# EAGLE design sdvx-controller-hardware (EAGLE 9.6.2)
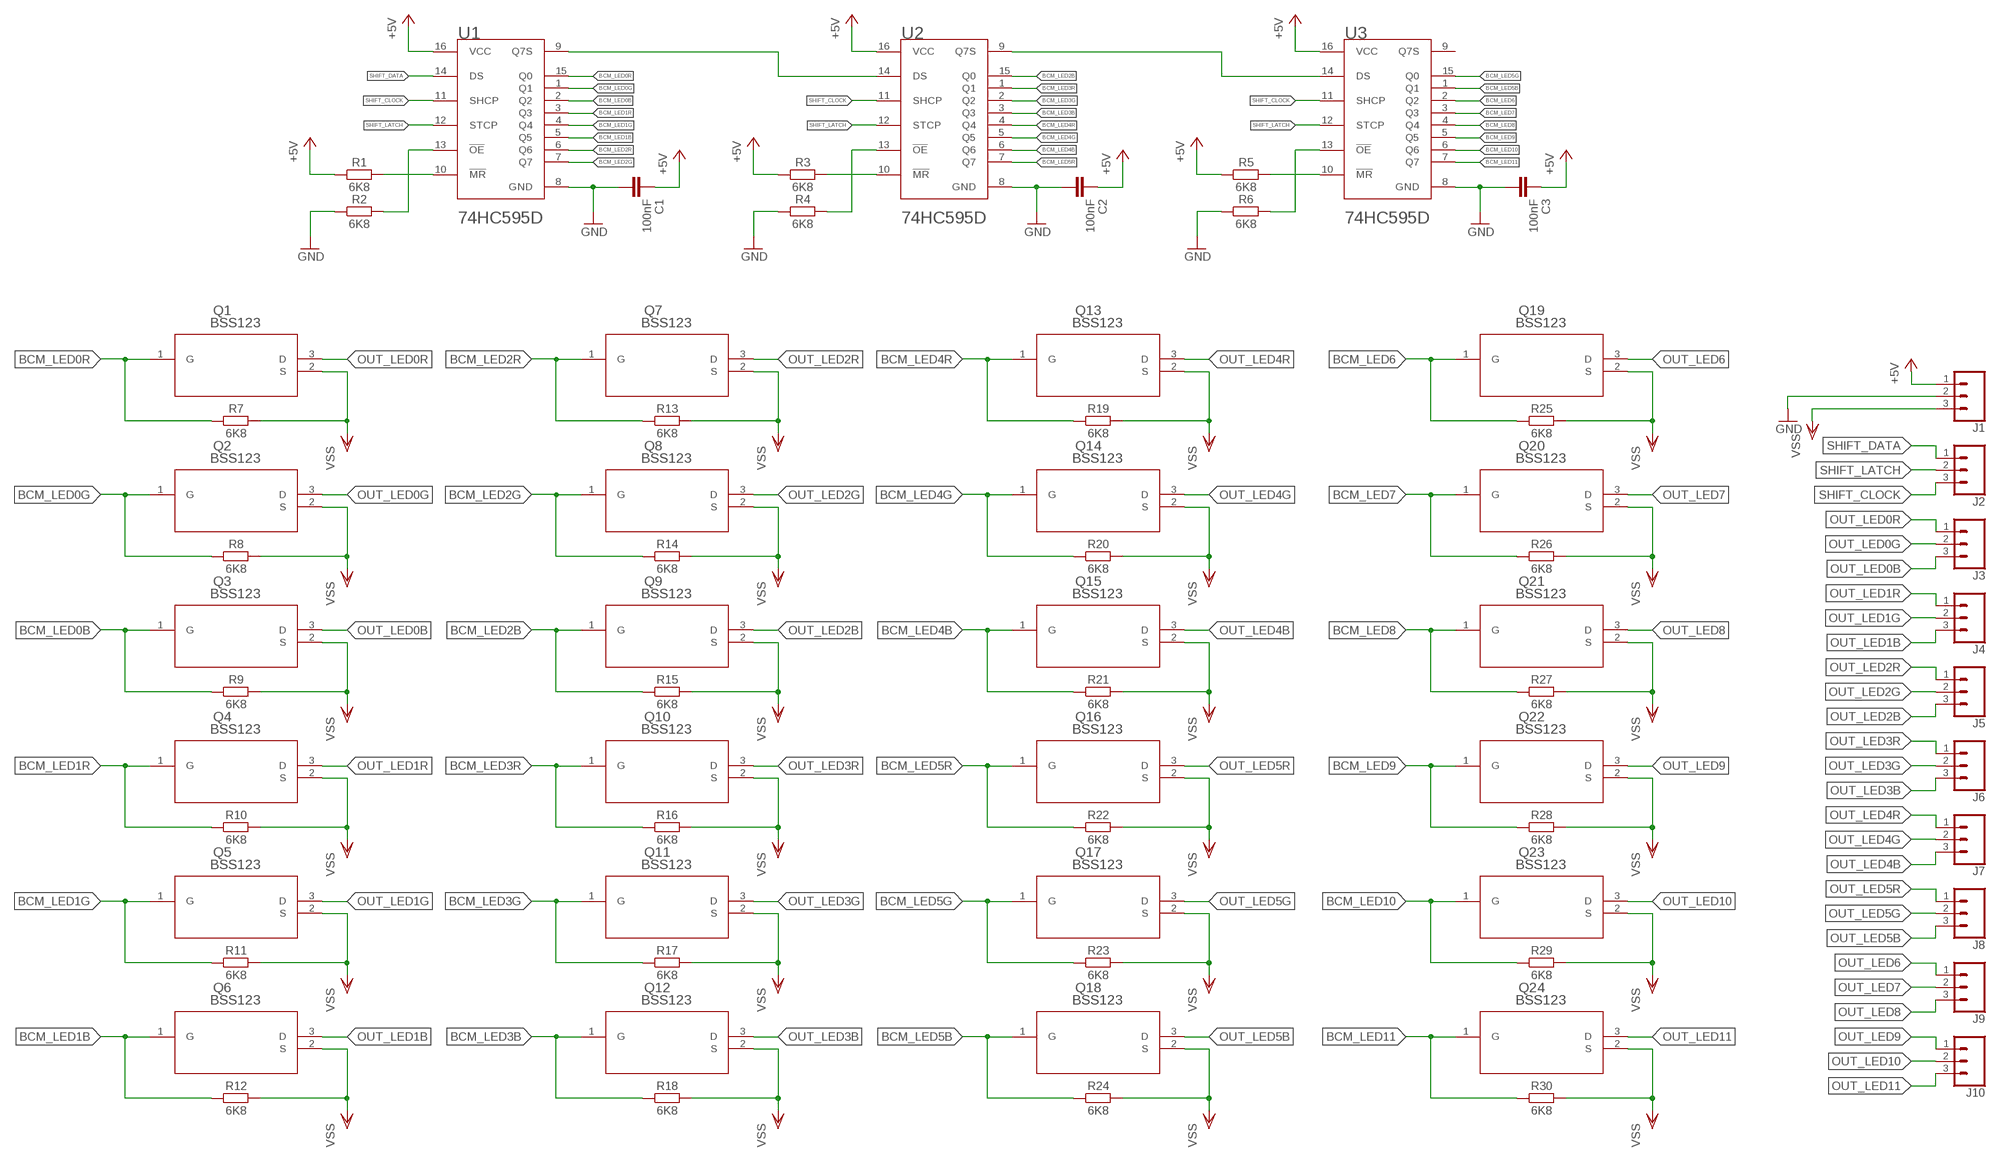
[diagram p0: schematic, sheet 1]

## Parts
C1  100nF  C_CHIP-0805(2012-METRIC)  [CAPC2012X110]
C2  100nF  C_CHIP-0805(2012-METRIC)  [CAPC2012X110]
C3  100nF  C_CHIP-0805(2012-METRIC)  [CAPC2012X110]
J1  CONN_03-SCREW-5MM  [SCREWTERMINAL-5MM-3]
J2  CONN_03-SCREW-5MM  [SCREWTERMINAL-5MM-3]
J3  CONN_03-SCREW-5MM  [SCREWTERMINAL-5MM-3]
J4  CONN_03-SCREW-5MM  [SCREWTERMINAL-5MM-3]
J5  CONN_03-SCREW-5MM  [SCREWTERMINAL-5MM-3]
J6  CONN_03-SCREW-5MM  [SCREWTERMINAL-5MM-3]
J7  CONN_03-SCREW-5MM  [SCREWTERMINAL-5MM-3]
J8  CONN_03-SCREW-5MM  [SCREWTERMINAL-5MM-3]
J9  CONN_03-SCREW-5MM  [SCREWTERMINAL-5MM-3]
J10  CONN_03-SCREW-5MM  [SCREWTERMINAL-5MM-3]
Q1  BSS123  BSS123LT1  [SOT-23-3_1P4X3P040_ONS]
Q2  BSS123  BSS123LT1  [SOT-23-3_1P4X3P040_ONS]
Q3  BSS123  BSS123LT1  [SOT-23-3_1P4X3P040_ONS]
Q4  BSS123  BSS123LT1  [SOT-23-3_1P4X3P040_ONS]
Q5  BSS123  BSS123LT1  [SOT-23-3_1P4X3P040_ONS]
Q6  BSS123  BSS123LT1  [SOT-23-3_1P4X3P040_ONS]
Q7  BSS123  BSS123LT1  [SOT-23-3_1P4X3P040_ONS]
Q8  BSS123  BSS123LT1  [SOT-23-3_1P4X3P040_ONS]
Q9  BSS123  BSS123LT1  [SOT-23-3_1P4X3P040_ONS]
Q10  BSS123  BSS123LT1  [SOT-23-3_1P4X3P040_ONS]
Q11  BSS123  BSS123LT1  [SOT-23-3_1P4X3P040_ONS]
Q12  BSS123  BSS123LT1  [SOT-23-3_1P4X3P040_ONS]
Q13  BSS123  BSS123LT1  [SOT-23-3_1P4X3P040_ONS]
Q14  BSS123  BSS123LT1  [SOT-23-3_1P4X3P040_ONS]
Q15  BSS123  BSS123LT1  [SOT-23-3_1P4X3P040_ONS]
Q16  BSS123  BSS123LT1  [SOT-23-3_1P4X3P040_ONS]
Q17  BSS123  BSS123LT1  [SOT-23-3_1P4X3P040_ONS]
Q18  BSS123  BSS123LT1  [SOT-23-3_1P4X3P040_ONS]
Q19  BSS123  BSS123LT1  [SOT-23-3_1P4X3P040_ONS]
Q20  BSS123  BSS123LT1  [SOT-23-3_1P4X3P040_ONS]
Q21  BSS123  BSS123LT1  [SOT-23-3_1P4X3P040_ONS]
Q22  BSS123  BSS123LT1  [SOT-23-3_1P4X3P040_ONS]
Q23  BSS123  BSS123LT1  [SOT-23-3_1P4X3P040_ONS]
Q24  BSS123  BSS123LT1  [SOT-23-3_1P4X3P040_ONS]
R1  6K8  R_CHIP-0805(2012-METRIC)  [RESC2012X65]
R2  6K8  R_CHIP-0805(2012-METRIC)  [RESC2012X65]
R3  6K8  R_CHIP-0805(2012-METRIC)  [RESC2012X65]
R4  6K8  R_CHIP-0805(2012-METRIC)  [RESC2012X65]
R5  6K8  R_CHIP-0805(2012-METRIC)  [RESC2012X65]
R6  6K8  R_CHIP-0805(2012-METRIC)  [RESC2012X65]
R7  6K8  R_CHIP-0805(2012-METRIC)  [RESC2012X65]
R8  6K8  R_CHIP-0805(2012-METRIC)  [RESC2012X65]
R9  6K8  R_CHIP-0805(2012-METRIC)  [RESC2012X65]
R10  6K8  R_CHIP-0805(2012-METRIC)  [RESC2012X65]
R11  6K8  R_CHIP-0805(2012-METRIC)  [RESC2012X65]
R12  6K8  R_CHIP-0805(2012-METRIC)  [RESC2012X65]
R13  6K8  R_CHIP-0805(2012-METRIC)  [RESC2012X65]
R14  6K8  R_CHIP-0805(2012-METRIC)  [RESC2012X65]
R15  6K8  R_CHIP-0805(2012-METRIC)  [RESC2012X65]
R16  6K8  R_CHIP-0805(2012-METRIC)  [RESC2012X65]
R17  6K8  R_CHIP-0805(2012-METRIC)  [RESC2012X65]
R18  6K8  R_CHIP-0805(2012-METRIC)  [RESC2012X65]
R19  6K8  R_CHIP-0805(2012-METRIC)  [RESC2012X65]
R20  6K8  R_CHIP-0805(2012-METRIC)  [RESC2012X65]
R21  6K8  R_CHIP-0805(2012-METRIC)  [RESC2012X65]
R22  6K8  R_CHIP-0805(2012-METRIC)  [RESC2012X65]
R23  6K8  R_CHIP-0805(2012-METRIC)  [RESC2012X65]
R24  6K8  R_CHIP-0805(2012-METRIC)  [RESC2012X65]
R25  6K8  R_CHIP-0805(2012-METRIC)  [RESC2012X65]
R26  6K8  R_CHIP-0805(2012-METRIC)  [RESC2012X65]
R27  6K8  R_CHIP-0805(2012-METRIC)  [RESC2012X65]
R28  6K8  R_CHIP-0805(2012-METRIC)  [RESC2012X65]
R29  6K8  R_CHIP-0805(2012-METRIC)  [RESC2012X65]
R30  6K8  R_CHIP-0805(2012-METRIC)  [RESC2012X65]
U1  NEXPERIA_74HC595DNEXPERIA_74HC595D_0_0  [NEXPERIA_74HC595D_0]
U2  NEXPERIA_74HC595DNEXPERIA_74HC595D_0_0  [NEXPERIA_74HC595D_0]
U3  NEXPERIA_74HC595DNEXPERIA_74HC595D_0_0  [NEXPERIA_74HC595D_0]

## Nets
+5V: C1.1 C2.1 C3.1 J1.1 R1.1 R3.1 R5.1 U1.16(VCC) U2.16(VCC) U3.16(VCC)
BCM_LED0B: Q3.1(G) R9.1 U1.2(Q2)
BCM_LED0G: Q2.1(G) R8.1 U1.1(Q1)
BCM_LED0R: Q1.1(G) R7.1 U1.15(Q0)
BCM_LED1B: Q6.1(G) R12.1 U1.5(Q5)
BCM_LED1G: Q5.1(G) R11.1 U1.4(Q4)
BCM_LED1R: Q4.1(G) R10.1 U1.3(Q3)
BCM_LED2B: Q9.1(G) R15.1 U2.15(Q0)
BCM_LED2G: Q8.1(G) R14.1 U1.7(Q7)
BCM_LED2R: Q7.1(G) R13.1 U1.6(Q6)
BCM_LED3B: Q12.1(G) R18.1 U2.3(Q3)
BCM_LED3G: Q11.1(G) R17.1 U2.2(Q2)
BCM_LED3R: Q10.1(G) R16.1 U2.1(Q1)
BCM_LED4B: Q15.1(G) R21.1 U2.6(Q6)
BCM_LED4G: Q14.1(G) R20.1 U2.5(Q5)
BCM_LED4R: Q13.1(G) R19.1 U2.4(Q4)
BCM_LED5B: Q18.1(G) R24.1 U3.1(Q1)
BCM_LED5G: Q17.1(G) R23.1 U3.15(Q0)
BCM_LED5R: Q16.1(G) R22.1 U2.7(Q7)
BCM_LED6: Q19.1(G) R25.1 U3.2(Q2)
BCM_LED7: Q20.1(G) R26.1 U3.3(Q3)
BCM_LED8: Q21.1(G) R27.1 U3.4(Q4)
BCM_LED9: Q22.1(G) R28.1 U3.5(Q5)
BCM_LED10: Q23.1(G) R29.1 U3.6(Q6)
BCM_LED11: Q24.1(G) R30.1 U3.7(Q7)
GND: C1.2 C2.2 C3.2 J1.2 R2.1 R4.1 R6.1 U1.8(GND) U2.8(GND) U3.8(GND)
N$1: R1.2 U1.10(!MR!)
N$2: R2.2 U1.13(!OE!)
N$3: R4.2 U2.13(!OE!)
N$4: R3.2 U2.10(!MR!)
N$5: R6.2 U3.13(!OE!)
N$6: R5.2 U3.10(!MR!)
N$7: U1.9(Q7S) U2.14(DS)
N$8: U2.9(Q7S) U3.14(DS)
OUT_LED0B: J3.3 Q3.3(D)
OUT_LED0G: J3.2 Q2.3(D)
OUT_LED0R: J3.1 Q1.3(D)
OUT_LED1B: J4.3 Q6.3(D)
OUT_LED1G: J4.2 Q5.3(D)
OUT_LED1R: J4.1 Q4.3(D)
OUT_LED2B: J5.3 Q9.3(D)
OUT_LED2G: J5.2 Q8.3(D)
OUT_LED2R: J5.1 Q7.3(D)
OUT_LED3B: J6.3 Q12.3(D)
OUT_LED3G: J6.2 Q11.3(D)
OUT_LED3R: J6.1 Q10.3(D)
OUT_LED4B: J7.3 Q15.3(D)
OUT_LED4G: J7.2 Q14.3(D)
OUT_LED4R: J7.1 Q13.3(D)
OUT_LED5B: J8.3 Q18.3(D)
OUT_LED5G: J8.2 Q17.3(D)
OUT_LED5R: J8.1 Q16.3(D)
OUT_LED6: J9.1 Q19.3(D)
OUT_LED7: J9.2 Q20.3(D)
OUT_LED8: J9.3 Q21.3(D)
OUT_LED9: J10.1 Q22.3(D)
OUT_LED10: J10.2 Q23.3(D)
OUT_LED11: J10.3 Q24.3(D)
SHIFT_CLOCK: J2.3 U1.11(SHCP) U2.11(SHCP) U3.11(SHCP)
SHIFT_DATA: J2.1 U1.14(DS)
SHIFT_LATCH: J2.2 U1.12(STCP) U2.12(STCP) U3.12(STCP)
VSS: J1.3 Q1.2(S) Q2.2(S) Q3.2(S) Q4.2(S) Q5.2(S) Q6.2(S) Q7.2(S) Q8.2(S) Q9.2(S) Q10.2(S) Q11.2(S) Q12.2(S) Q13.2(S) Q14.2(S) Q15.2(S) Q16.2(S) Q17.2(S) Q18.2(S) Q19.2(S) Q20.2(S) Q21.2(S) Q22.2(S) Q23.2(S) Q24.2(S) R7.2 R8.2 R9.2 R10.2 R11.2 R12.2 R13.2 R14.2 R15.2 R16.2 R17.2 R18.2 R19.2 R20.2 R21.2 R22.2 R23.2 R24.2 R25.2 R26.2 R27.2 R28.2 R29.2 R30.2
Unconnected: U3.9(Q7S)

## Library data of the parts
C1-C3 = Capacitor:C: Capacitor - Generic; CATEGORY: Capacitor
J1-J10 = SparkFun-Connectors:CONN_03: Multi connection point. Often used as Generic Header-pin footprint for 0.1 inch spaced/style header connections On any of the 0.1 inch spaced packages, you can populate with these: Break Away Headers - Straight <https://www.sparkfun.com/products/116> (PRT-00116) Break Away Male Headers - Right Angle <https://www.sparkfun.com/products/553> (PRT-00553) Female Headers <https://www.sparkfun.com/products/115> (PRT-00115) Break Away Headers - Machine Pin <https://www.sparkfun.com/products/117> (PRT-00117) Break Away Female Headers - Swiss Machine Pin <https://www.sparkfun.com/products/743> (PRT-00743) Stackable Header - 3 Pin (Female, 0.1") <https://www.sparkfun.com/products/13875> (PRT-13875) For SCREWTERMINALS and SPRING TERMINALS visit here: Screw Terimnals on SparkFun.com <https://www.sparkfun.com/search/results?term=Screw+Terminals> (5mm/3.5mm/2.54mm spacing) This device is also useful as a general connection point to wire up your design to another part of your project. Our various solder wires solder well into these plated through hole pads. Hook-Up Wire - Assortment (Stranded, 22 AWG) <https://www.sparkfun.com/products/11375> (PRT-11375) Hook-Up Wire - Assortment (Solid Core, 22 AWG) <https://www.sparkfun.com/products/11367> (PRT-11367) View the entire wire category on our website here <https://www.sparkfun.com/categories/141> Special notes: Molex polarized connector foot print use with SKU : PRT-08232 with associated crimp pins and housings.; PROD_ID: CONN-10134; SF_SKU: PRT-08433
Q1-Q24 = BSS123:BSS123LT1; COPYRIGHT: Copyright (C) 2021 Ultra Librarian. All rights reserved.; MANUFACTURER_PART_NUMBER: BSS123LT1; MFR_NAME: ON Semiconductor
R1-R30 = Resistor:R: Resistor Fixed - Generic; CATEGORY: Resistor; SUB-CATEGORY: Fixed
U1-U3 = 74HC595D:NEXPERIA_74HC595D: 8-bit serial-in, serial or parallel-out shift register with output latches; 3-state; AMBIENT_TEMPERATURE_RANGE_HIGH: +125°C; AMBIENT_TEMPERATURE_RANGE_LOW: -40°C; AUTOMOTIVE: No; CENTROID_NOT_SPECIFIED: No; DATASHEET: https://assets.nexperia.com/documents/data-sheet/74HC_HCT595.pdf; DEVICE_CLASS_L1: Integrated Circuits (ICs); DEVICE_CLASS_L2: Logic ICs; DEVICE_CLASS_L3: Shift Registers; DIGIKEY_DESCRIPTION: IC SHIFT REGISTER 8BIT 16SOIC; DIGIKEY_PART_NUMBER: 1727-2821-1-ND; FOOTPRINT_PARAMETERS_1: {"fp_type":"SOIC_narrow","params":{"N":{"nom":16,"long name":"Number of leads","min":null,"max":null,"short name":"N","type":"count"},"A":{"nom":false,"long name":"Height","min":false,"max":1750000,"short name":"A","type":"measurement"},"A1":{"nom":false,"long name":"Package clearance","min":100000,"max":250000,"short name":"A1","type":"measurement"},"A2":{"nom":false,"long name":"Package height","min":1250000,"max":1450000,"short name":"A2","type":"measurement"},"D":{"nom":false,"long name":"Package length","min":9800000,"max":10000000,"short name":"D","type":"measurement"},"E":{"nom":false,"long name":"Width w/ leads","min":5800000,"max":6200000,"short name":"E","type":"measurement"},"E1":{"nom":false,"long name":"Package width","min":3800000,"max":4000000,"short name":"E1","type":"measurement"},"B":{"nom":false,"long name":"Lead width","min":360000,"max":490000,"short name":"B","type":"measurement"},"C":{"nom":false,"long name":"Lead thickness","min":190000,"max":250000,"short name":"C","type":"measurement"},"e":{"nom":1270000,"long name":"Lead pitch","min":null,"max":null,"short name":"e","type":"measurement"},"L":{"nom":false,"long name":"Lead foot length","min":400000,"max":1000000,"short name":"L","type":"measurement"},"PHI":{"nom":false,"long name":"Lead foot angle","min":0,"max":8,"short name":"PHI","type":"measurement"},"HT":{"default":"No","long name":"Thermal pad","type":"multichoiceparent","short name":"HT","children":[]},"offset x":{"nom":0,"long name":"X Center offset","min":null,"max":null,"short name":"offset x","type":"measurement"},"offset y":{"nom":0,"long name":"Y Center offset","min":null,"max":null,"short name":"offset y","type":"measurement"},"LS":{"default":"Rounded rectangle","long name":"Land shape","type":"multichoice","short name":"LS"},"LS1":{"default":"Rectangle","long name":"Land shape (Pin 1)","type":"multichoice","short name":"LS1"},"solder toe":{"nom":550000,"long name":"Solder fillet (toe)","min":null,"max":null,"short name":"solder toe","type":"fixedmeasurement"},"solder heel":{"nom":450000,"long name":"Solder fillet (heel)","min":null,"max":null,"short name":"solder heel","type":"fixedmeasurement"},"solder side":{"nom":50000,"long name":"Solder fillet (side)","min":null,"max":null,"short name":"solder side","type":"fixedmeasurement"},"courtyard":{"nom":500000,"long name":"Courtyard","min":null,"max":null,"short name":"courtyard","type":"fixedmeasurement"},"SF":{"default":"A","long name":"Packing level","type":"multichoiceparent","short name":"SF","help":"http://support.upverter.com/customer/portal/articles/978783-what-is-a-footprint-packing-level","children":["solder toe","solder heel","solder side","courtyard"]}}}; FOOTPRINT_PARAMETERS_2: {"fp_type":"SOIC_narrow","params":{"N":{"nom":16,"long name":"Number of leads","min":null,"max":null,"short name":"N","type":"count"},"A":{"nom":false,"long name":"Height","min":false,"max":1750000,"short name":"A","type":"measurement"},"A1":{"nom":false,"long name":"Package clearance","min":100000,"max":250000,"short name":"A1","type":"measurement"},"A2":{"nom":false,"long name":"Package height","min":1250000,"max":1450000,"short name":"A2","type":"measurement"},"D":{"nom":false,"long name":"Package length","min":9800000,"max":10000000,"short name":"D","type":"measurement"},"E":{"nom":false,"long name":"Width w/ leads","min":5800000,"max":6200000,"short name":"E","type":"measurement"},"E1":{"nom":false,"long name":"Package width","min":3800000,"max":4000000,"short name":"E1","type":"measurement"},"B":{"nom":false,"long name":"Lead width","min":360000,"max":490000,"short name":"B","type":"measurement"},"C":{"nom":false,"long name":"Lead thickness","min":190000,"max":250000,"short name":"C","type":"measurement"},"e":{"nom":1270000,"long name":"Lead pitch","min":null,"max":null,"short name":"e","type":"measurement"},"L":{"nom":false,"long name":"Lead foot length","min":400000,"max":1000000,"short name":"L","type":"measurement"},"PHI":{"nom":false,"long name":"Lead foot angle","min":0,"max":8,"short name":"PHI","type":"measurement"},"HT":{"default":"No","long name":"Thermal pad","type":"multichoiceparent","short name":"HT","children":[]},"offset x":{"nom":0,"long name":"X Center offset","min":null,"max":null,"short name":"offset x","type":"measurement"},"offset y":{"nom":0,"long name":"Y Center offset","min":null,"max":null,"short name":"offset y","type":"measurement"},"LS":{"default":"Rounded rectangle","long name":"Land shape","type":"multichoice","short name":"LS"},"LS1":{"default":"Rectangle","long name":"Land shape (Pin 1)","type":"multichoice","short name":"LS1"},"solder toe":{"nom":350000,"long name":"Solder fillet (toe)","min":null,"max":null,"short name":"solder toe","type":"fixedmeasurement"},"solder heel":{"nom":350000,"long name":"Solder fillet (heel)","min":null,"max":null,"short name":"solder heel","type":"fixedmeasurement"},"solder side":{"nom":30000,"long name":"Solder fillet (side)","min":null,"max":null,"short name":"solder side","type":"fixedmeasurement"},"courtyard":{"nom":250000,"long name":"Courtyard","min":null,"max":null,"short name":"courtyard","type":"fixedmeasurement"},"SF":{"default":"B","long name":"Packing level","type":"multichoiceparent","short name":"SF","help":"http://support.upverter.com/customer/portal/articles/978783-what-is-a-footprint-packing-level","children":["solder toe","solder heel","solder side","courtyard"]}}}; FOOTPRINT_PARAMETERS_3: {"fp_type":"SOIC_narrow","params":{"N":{"nom":16,"long name":"Number of leads","min":null,"max":null,"short name":"N","type":"count"},"A":{"nom":false,"long name":"Height","min":false,"max":1750000,"short name":"A","type":"measurement"},"A1":{"nom":false,"long name":"Package clearance","min":100000,"max":250000,"short name":"A1","type":"measurement"},"A2":{"nom":false,"long name":"Package height","min":1250000,"max":1450000,"short name":"A2","type":"measurement"},"D":{"nom":false,"long name":"Package length","min":9800000,"max":10000000,"short name":"D","type":"measurement"},"E":{"nom":false,"long name":"Width w/ leads","min":5800000,"max":6200000,"short name":"E","type":"measurement"},"E1":{"nom":false,"long name":"Package width","min":3800000,"max":4000000,"short name":"E1","type":"measurement"},"B":{"nom":false,"long name":"Lead width","min":360000,"max":490000,"short name":"B","type":"measurement"},"C":{"nom":false,"long name":"Lead thickness","min":190000,"max":250000,"short name":"C","type":"measurement"},"e":{"nom":1270000,"long name":"Lead pitch","min":null,"max":null,"short name":"e","type":"measurement"},"L":{"nom":false,"long name":"Lead foot length","min":400000,"max":1000000,"short name":"L","type":"measurement"},"PHI":{"nom":false,"long name":"Lead foot angle","min":0,"max":8,"short name":"PHI","type":"measurement"},"HT":{"default":"No","long name":"Thermal pad","type":"multichoiceparent","short name":"HT","children":[]},"offset x":{"nom":0,"long name":"X Center offset","min":null,"max":null,"short name":"offset x","type":"measurement"},"offset y":{"nom":0,"long name":"Y Center offset","min":null,"max":null,"short name":"offset y","type":"measurement"},"LS":{"default":"Rounded rectangle","long name":"Land shape","type":"multichoice","short name":"LS"},"LS1":{"default":"Rectangle","long name":"Land shape (Pin 1)","type":"multichoice","short name":"LS1"},"solder toe":{"nom":150000,"long name":"Solder fillet (toe)","min":null,"max":null,"short name":"solder toe","type":"fixedmeasurement"},"solder heel":{"nom":250000,"long name":"Solder fillet (heel)","min":null,"max":null,"short name":"solder heel","type":"fixedmeasurement"},"solder side":{"nom":10000,"long name":"Solder fillet (side)","min":null,"max":null,"short name":"solder side","type":"fixedmeasurement"},"courtyard":{"nom":100000,"long name":"Courtyard","min":null,"max":null,"short name":"courtyard","type":"fixedmeasurement"},"SF":{"default":"C","long name":"Packing level","type":"multichoiceparent","short name":"SF","help":"http://support.upverter.com/customer/portal/articles/978783-what-is-a-footprint-packing-level","children":["solder toe","solder heel","solder side","courtyard"]}}}; FOOTPRINT_URL: https://assets.nexperia.com/documents/outline-drawing/SOT109-1.pdf; FOOTPRINT_VARIANT_NAME_0: Recommended_Land_Pattern; FOOTPRINT_VARIANT_NAME_1: IPC_A; FOOTPRINT_VARIANT_NAME_2: IPC_B; FOOTPRINT_VARIANT_NAME_3: IPC_C; FREQUENCY: 108MHz; HEIGHT: 1.75mm; IPC_LAND_PATTERN_NAME: SOIC127P600X175-16; LEAD_FREE: Yes; MAX_SUPPLY_VOLTAGE: 6V; MF: Nexperia; MFG_PACKAGE_IDENT: SOT109-1; MFG_PACKAGE_IDENT_DATE: 10/2018; MFG_PACKAGE_IDENT_REV: 0; MIN_SUPPLY_VOLTAGE: 2V; MOUSER_DESCRIPTION: 74HC(T)595 - 8-bit serial-in, serial or parallel-out shift register with output latches; 3-state; MOUSER_PART_NUMBER: 771-74HC595D-T; MPN: 74HC595D; NOMINAL_SUPPLY_CURRENT: 70mA; NUMBER_OF_CIRCUITS: 1; NUMBER_OF_INPUTS: 1; NUMBER_OF_OUTPUTS: 8; PACKAGE: SO16; PIN_0_0_13_INSIDE_EDGE: clock; PIN_0_0_14_INSIDE_EDGE: clock; PREFIX: U; PROPAGATION_DELAY: 16ns; ROHS: Yes; STANDOFF_HEIGHT: 0.1mm; TEMPERATURE_RANGE_HIGH: +125°C; TEMPERATURE_RANGE_LOW: -40°C; VERIFICATION_VERSION: 0.0.0.1

## Board
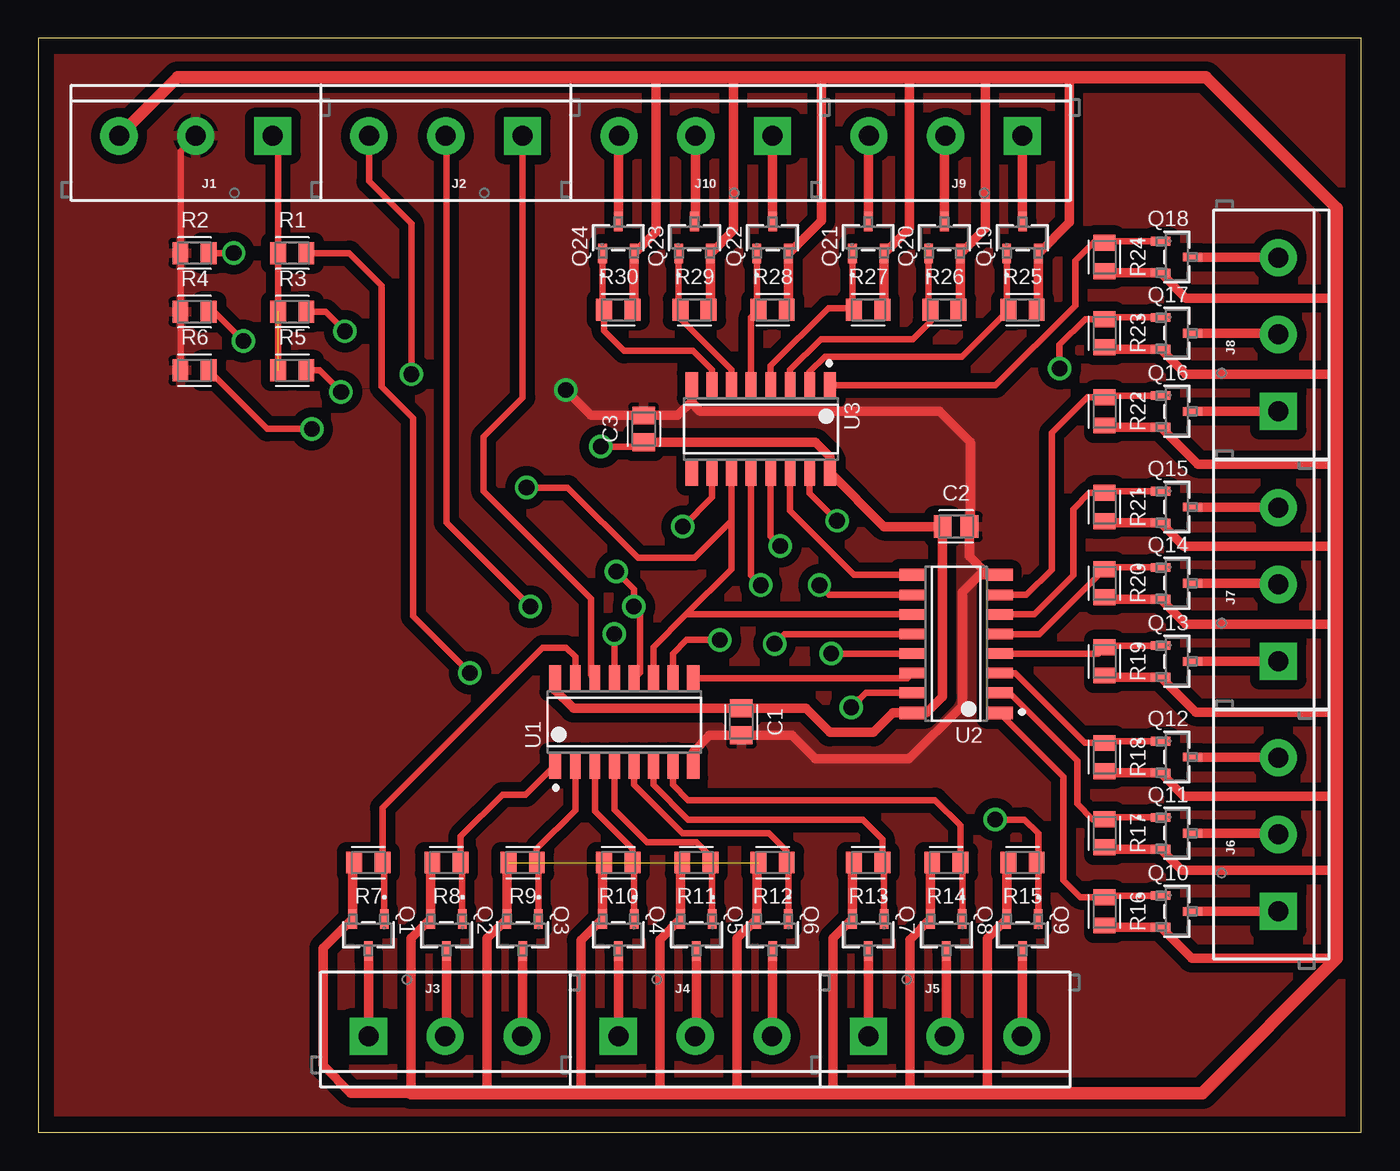
[diagram p1: board, top side]
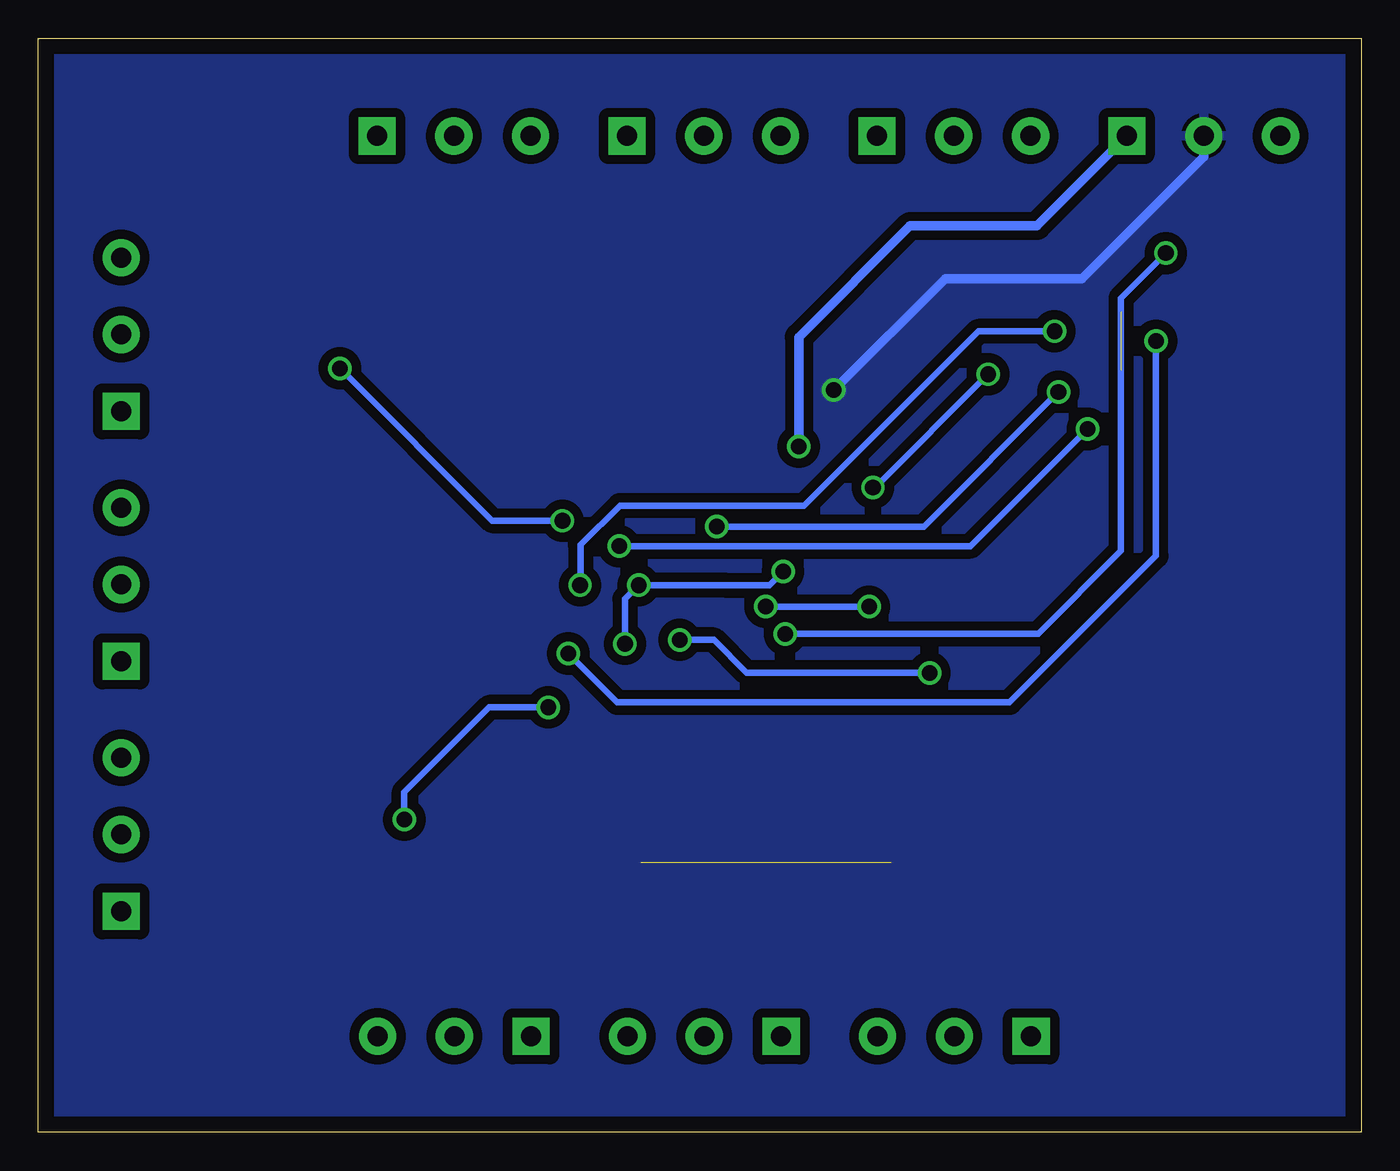
[diagram p2: board, bottom side, seen from below]

Size 86.03 x 71.11 mm. Coordinates in mm from the lower left corner, seen from the top.
Outline: 0,0 86.03,0 86.03,71.11 0,71.11 0,0
Copper layers (1*16): Top 0.035mm / dielectric 1.5mm / Bottom 0.035mm
Design rules "default": minimum track width 6mil, minimum drill 0.35mm, track to track 6mil, track to pad 6mil, pad to pad 6mil, via to via 6mil, smd to smd 6mil, copper to edge 40mil, drill to drill 6mil, minimum pad ring 10mil, minimum via ring 8mil, stop-mask expansion 4mil, vias tented up to drill 0mil, thermal gap 10mil

### Footprints (pad centres in the part's own frame; a part is rotated, then mirrored left to right if it is on the bottom)
CAPC2012X110 = smd 1.165 x 1.465: 1 -0.875,0; 2 0.875,0
SCREWTERMINAL-5MM-3 = drill 1.3 pad 2.413 square: 1 0,0 | drill 1.3 pad 2.413: 2 5,0; 3 10,0
SOT-23-3_1P4X3P040_ONS = smd 0.559 x 1.27: 1 -1.029,-1.041; 2 1.029,-1.041; 3 0,1.041
RESC2012X65 = smd 1.031 x 1.42: 1 -0.919,0; 2 0.919,0
NEXPERIA_74HC595D_0 = smd 1.75 x 0.8: 1 -2.825,4.495; 8 -2.825,-4.495; 9 2.825,-4.495; 16 2.825,4.495 | smd 1.75 x 0.7: 2 -2.825,3.175; 3 -2.825,1.905; 4 -2.825,0.635; 5 -2.825,-0.635; 6 -2.825,-1.905; 7 -2.825,-3.175; 10 2.825,-3.175; 11 2.825,-1.905; 12 2.825,-0.635; 13 2.825,0.635; 14 2.825,1.905; 15 2.825,3.175 | smd 1.65 x 0.7: SMD_17 -2.825,-4.495; SMD_24 -2.825,4.495; SMD_25 2.825,-4.495; SMD_32 2.825,4.495 | smd 1.65 x 0.6: SMD_18 -2.825,-3.175; SMD_19 -2.825,-1.905; SMD_20 -2.825,-0.635; SMD_21 -2.825,0.635; SMD_22 -2.825,1.905; SMD_23 -2.825,3.175; SMD_26 2.825,-3.175; SMD_27 2.825,-1.905; SMD_28 2.825,-0.635; SMD_29 2.825,0.635; SMD_30 2.825,1.905; SMD_31 2.825,3.175

### Placement (x,y rotation side)
C1  45.72,26.67 270 top
C2  59.69,39.37 0 top
C3  39.37,45.72 90 top
J1  15.24,64.77 180 top
J2  31.5,64.77 180 top
J3  21.46,6.22 0 top
J4  37.72,6.22 0 top
J5  53.98,6.22 0 top
J6  80.64,14.35 90 top
J7  80.64,30.61 90 top
J8  80.64,46.86 90 top
J9  64.01,64.77 180 top
J10  47.75,64.77 180 top
Q1  21.46,12.83 180 top
Q2  26.54,12.83 180 top
Q3  31.5,12.83 180 top
Q4  37.72,12.83 180 top
Q5  42.8,12.83 180 top
Q6  47.75,12.83 180 top
Q7  53.98,12.83 180 top
Q8  59.05,12.83 180 top
Q9  64.01,12.83 180 top
Q10  74.04,14.35 270 top
Q11  74.04,19.43 270 top
Q12  74.04,24.38 270 top
Q13  74.04,30.61 270 top
Q14  74.04,35.69 270 top
Q15  74.04,40.64 270 top
Q16  74.04,46.86 270 top
Q17  74.04,51.94 270 top
Q18  74.04,56.9 270 top
Q19  64.01,58.17 0 top
Q20  58.93,58.17 0 top
Q21  53.98,58.17 0 top
Q22  47.75,58.17 0 top
Q23  42.67,58.17 0 top
Q24  37.72,58.17 0 top
R1  16.51,57.15 0 top
R2  10.16,57.15 0 top
R3  16.51,53.34 0 top
R4  10.16,53.34 0 top
R5  16.51,49.53 0 top
R6  10.16,49.53 0 top
R7  21.46,17.53 180 top
R8  26.54,17.53 180 top
R9  31.5,17.53 180 top
R10  37.72,17.53 180 top
R11  42.8,17.53 180 top
R12  47.75,17.53 180 top
R13  53.98,17.53 180 top
R14  59.05,17.53 180 top
R15  64.01,17.53 180 top
R16  69.34,14.35 270 top
R17  69.34,19.43 270 top
R18  69.34,24.38 270 top
R19  69.34,30.61 270 top
R20  69.34,35.69 270 top
R21  69.34,40.64 270 top
R22  69.34,46.86 270 top
R23  69.34,51.94 270 top
R24  69.34,56.9 270 top
R25  64.01,53.47 0 top
R26  58.93,53.47 0 top
R27  53.98,53.47 0 top
R28  47.75,53.47 0 top
R29  42.67,53.47 0 top
R30  37.72,53.47 0 top
U1  38.1,26.67 90 top
U2  59.69,31.75 180 top
U3  46.99,45.72 270 top

### Tracks (layer width: path | path; a pad name or v marks a point on that pad's centre or on a via)
+5V  (via drill 1.02)  (1 unrouted)
  Top 0.406: J1.1 15.59,64.42 R1.1 R5.1 | v36.58,44.58 39.1,44.58 C3.1
  Top 0.61: U1.16 33.6,28.73 34.79,27.55 C1.1 49.91,27.55 51.47,25.98 54.33,25.98 55.59,27.25 U2.16 57.75,27.25 58.81,28.32 C2.1 55.01,39.37 U3.16 51.48,43.91 50.55,44.84 C3.1
  Bottom 0.61: J1.1 21.08,58.93 29.34,58.93 36.58,51.69 v36.58,44.58
BCM_LED0B
  Top 0.406: Q3.1 32.52,17.42 R9.1 32.42,18.41 34.92,20.92 U1.2
BCM_LED0G
  Top 0.406: Q2.1 27.57,17.42 R8.1 27.46,19.23 30.18,21.94 31.7,21.94 U1.1
BCM_LED0R
  Top 0.406: Q1.1 22.49,17.42 R7.1 22.38,21.08 32.8,31.5 34.31,31.5 34.92,30.89 U1.15
BCM_LED1B
  Top 0.406: Q6.1 48.78,17.42 R12.1 48.67,18.29 47.53,19.43 41.88,19.43 38.73,22.57 U1.5
BCM_LED1G
  Top 0.406: Q5.1 43.83,17.42 R11.1 43.72,17.92 42.8,18.85 39.57,18.85 37.47,20.95 U1.4
BCM_LED1R
  Top 0.406: Q4.1 38.75,17.42 R10.1 38.64,18.41 36.2,20.86 U1.3
BCM_LED2B  (via drill 1.02)
  Top 0.406: Q9.1 65.04,17.42 | 65.04,17.42 R15.1 | U2.15 53.82,28.57 53.26,28.02 | v62.23,20.32 64.14,20.32 65.04,19.42 65.04,17.42
  Top 0.61: 53.26,28.02 v52.86,27.62
  Bottom 0.406: v62.23,20.32 62.23,22.1 56.71,27.62 v52.86,27.62
BCM_LED2G
  Top 0.406: Q8.1 60.08,17.42 R14.1 59.97,19.94 58.32,21.59 42.26,21.59 41.27,22.57 U1.7
BCM_LED2R
  Top 0.406: Q7.1 55,17.42 R13.1 54.9,19.05 53.62,20.32 42.26,20.32 40.01,22.57 U1.6
BCM_LED3B
  Top 0.406: Q12.1 69.45,25.41 R18.1 68.07,25.3 63.53,29.84 U2.3
BCM_LED3G
  Top 0.406: Q11.1 69.45,20.46 R17.1 68.55,20.35 67.56,21.34 67.56,24.16 63.15,28.57 U2.2
BCM_LED3R
  Top 0.406: Q10.1 69.45,15.38 R16.1 67.79,15.27 66.67,16.38 66.67,23.09 U2.1
BCM_LED4B
  Top 0.406: Q15.1 69.45,41.67 R21.1 68.36,41.56 67.31,40.51 67.31,36.2 64.77,33.66 U2.6
BCM_LED4G
  Top 0.406: Q14.1 69.45,36.72 R20.1 65.12,32.38 U2.5
BCM_LED4R
  Top 0.406: Q13.1 69.45,31.64 R19.1 68.93,31.11 U2.4
BCM_LED5B
  Top 0.406: Q18.1 69.45,57.92 | 69.45,57.92 R24.1 | U3.1 62.26,48.55 67.44,53.72 67.44,56.64 68.72,57.92 69.45,57.92
BCM_LED5G  (via drill 1.02)
  Top 0.406: Q17.1 69.45,52.97 R23.1 68.1,52.86 66.42,51.18 v66.42,49.66 | U3.15 50.16,41.53 v51.94,39.75
  Bottom 0.406: v66.42,49.66 56.52,39.75 v51.94,39.75
BCM_LED5R
  Top 0.406: Q16.1 69.45,47.89 R22.1 68.23,47.78 65.91,45.47 65.91,36.58 64.26,34.92 U2.7
BCM_LED6
  Top 0.406: Q19.1 62.98,53.58 R25.1 63.09,53.44 60.07,50.42 51.15,50.42 50.16,49.43 U3.2
BCM_LED7
  Top 0.406: Q20.1 57.9,53.58 R26.1 58.01,52.67 56.9,51.56 50.9,51.56 48.9,49.56 U3.3
BCM_LED8
  Top 0.406: Q21.1 52.95,53.58 | 52.95,53.58 R27.1 | U3.4 47.62,49.81 51.39,53.58 52.95,53.58
BCM_LED9
  Top 0.406: Q22.1 46.72,53.58 R28.1 46.35,52.99 U3.5
BCM_LED10
  Top 0.406: Q23.1 41.64,53.58 R29.1 41.75,52.89 45.09,49.56 U3.6
BCM_LED11
  Top 0.406: Q24.1 36.69,53.58 R30.1 36.8,52.1 38.1,50.8 42.58,50.8 43.81,49.56 U3.7
GND  (via drill 1.02)
  Top 0.406: R6.1 R2.1 9.24,63.77 J1.2
  Top 0.61: U1.8 42.59,24.73 43.66,25.8 C1.2 49.02,25.8 50.55,24.27 56.64,24.27 60.1,27.74 60.1,35.1 61.24,36.24 U2.8 61.75,36.24 60.56,37.43 C2.2 60.62,39.42 60.62,44.86 58.6,46.88 43.04,46.88 42.49,47.42 U3.8 42.49,47.53 41.56,46.59 C3.2 35.95,46.59 v34.29,48.26
  Bottom 0.61: v34.29,48.26 27.05,55.5 18.15,55.5 10.24,63.41 J1.2
  pour Top (isolate 0.61): 0,71.12 86.36,71.12 86.36,0 0,0
  pour Bottom (isolate 0.61): 0,71.12 86.36,71.12 86.36,0 0,0
N$1  (via drill 1.02)
  Top 0.406: U1.10 41.27,31.11 42.16,32 v44.32,32 | R1.2 20.22,57.15 22.33,55.04 22.33,48.48 24.38,46.42 24.38,33.53 v28.07,29.84
  Bottom 0.406: v44.32,32 42.09,32 39.96,29.87 28.09,29.87 v28.07,29.84
N$2  (via drill 1.02)
  Top 0.406: v37.47,32.38 U1.13 | v12.7,57.15 R2.2
  Bottom 0.406: v37.47,32.38 37.44,32.41 21,32.41 15.62,37.79 15.62,54.23 v12.7,57.15
N$3  (via drill 1.02)
  Top 0.406: U2.13 v51.56,31.11 | v13.34,51.44 11.43,53.34 R4.2
  Bottom 0.406: v51.56,31.11 48.39,27.94 22.86,27.94 13.34,37.47 v13.34,51.44
N$4  (via drill 1.02)
  Top 0.406: U2.10 51.44,34.92 v50.8,35.56 | R3.2 18.67,53.34 v19.94,52.07
  Bottom 0.406: v19.94,52.07 24.89,52.07 36.22,40.74 48.22,40.74 50.77,38.18 50.77,35.59 v50.8,35.56
N$5  (via drill 1.02)
  Top 0.406: U3.13 47.62,38.73 v48.26,38.1 | v17.78,45.72 14.89,45.72 R6.2
  Bottom 0.406: v48.26,38.1 25.4,38.1 v17.78,45.72
N$6  (via drill 1.02)
  Top 0.406: U3.10 43.81,41.27 v41.91,39.37 | v19.68,48.13 18.29,49.53 R5.2
  Bottom 0.406: v41.91,39.37 28.45,39.37 v19.68,48.13
N$7
  Top 0.406: U1.9 56.52,29.5 U2.14
N$8
  Top 0.406: U2.9 53.04,36.24 48.9,40.39 U3.14
OUT_LED0B
  Top 0.61: Q3.3 31.5,6.26 J3.3
OUT_LED0G
  Top 0.61: Q2.3 26.54,6.3 J3.2
OUT_LED0R
  Top 0.61: Q1.3 J3.1
OUT_LED1B
  Top 0.61: Q6.3 47.75,6.26 J4.3
OUT_LED1G
  Top 0.61: Q5.3 42.8,6.3 J4.2
OUT_LED1R
  Top 0.61: Q4.3 J4.1
OUT_LED2B
  Top 0.61: Q9.3 64.01,6.26 J5.3
OUT_LED2G
  Top 0.61: Q8.3 59.05,6.3 J5.2
OUT_LED2R
  Top 0.61: Q7.3 J5.1
OUT_LED3B
  Top 0.61: Q12.3 80.61,24.38 J6.3
OUT_LED3G
  Top 0.61: Q11.3 80.56,19.43 J6.2
OUT_LED3R
  Top 0.61: Q10.3 J6.1
OUT_LED4B
  Top 0.61: Q15.3 80.61,40.64 J7.3
OUT_LED4G
  Top 0.61: Q14.3 80.56,35.69 J7.2
OUT_LED4R
  Top 0.61: Q13.3 J7.1
OUT_LED5B
  Top 0.61: Q18.3 80.61,56.9 J8.3
OUT_LED5G
  Top 0.61: Q17.3 80.56,51.94 J8.2
OUT_LED5R
  Top 0.61: Q16.3 J8.1
OUT_LED6
  Top 0.61: Q19.3 J9.1
OUT_LED7
  Top 0.61: Q20.3 58.93,64.69 J9.2
OUT_LED8
  Top 0.61: Q21.3 53.98,64.74 J9.3
OUT_LED9
  Top 0.61: Q22.3 J10.1
OUT_LED10
  Top 0.61: Q23.3 42.75,59.29 J10.2
OUT_LED11
  Top 0.61: Q24.3 37.72,64.74 J10.3
SHIFT_CLOCK  (via drill 1.02)
  Top 0.406: U1.11 40.01,31.53 42.13,33.66 | U2.11 42.13,33.66 | U3.11 45.09,39.75 | 45.09,39.75 45.09,36.61 42.13,33.66 | J2.3 21.5,61.82 24.26,59.05 v24.26,49.28 | v31.75,41.91 34.42,41.91 38.99,37.34 42.67,37.34 45.09,39.75
  Bottom 0.406: v31.75,41.91 31.62,41.91 v24.26,49.28
SHIFT_DATA
  Top 0.406: U1.14 35.94,29.75 35.94,34.67 28.96,41.66 28.96,45.21 29.72,45.97 31.5,47.75 J2.1
SHIFT_LATCH  (via drill 1.02)
  Top 0.406: U3.12 46.35,36.2 v46.99,35.56 | U2.12 48.51,32.38 v47.88,31.75 | U1.12 39.12,29.88 39.12,33.78 v38.73,34.16 38.73,35.31 v37.59,36.45 | J2.2 26.54,64.72 26.54,39.62 v32,34.16
  Bottom 0.406: v47.88,31.75 47.88,34.67 v46.99,35.56 41.91,35.56 41.4,35.56 38.48,35.56 v37.59,36.45 | v38.73,34.16 v32,34.16
VSS  (3 unrouted)
  Top 0.61: R7.2 20.43,17.42 Q1.2 18.53,11.96 18.53,4.33 20.32,2.54 24.24,2.54 24.24,12.6 Q2.2 25.51,17.42 R8.2 | R9.2 30.47,17.42 Q3.2 29.2,12.6 29.2,2.54 | R10.2 36.69,17.42 Q4.2 35.29,12.47 35.29,2.54 | R11.2 41.77,17.42 Q5.2 40.42,12.52 40.42,2.54 | R12.2 46.72,17.42 Q6.2 45.45,12.6 45.45,2.54 | R13.2 52.95,17.42 Q7.2 51.68,12.6 51.68,2.93 52.07,2.54 | R14.2 58.03,17.42 Q8.2 56.68,12.52 56.68,2.54 | R15.2 62.98,17.42 Q9.2 61.71,12.6 61.71,2.54 | R16.2 69.45,13.32 Q10.2 75.02,11.3 84.45,11.3 | R17.2 69.45,18.4 Q11.2 74.38,17.02 84.45,17.02 | R18.2 69.45,23.36 Q12.2 74.51,21.84 84.45,21.84 | R19.2 69.45,29.58 Q13.2 75.27,27.3 84.45,27.3 | R20.2 69.45,34.66 Q14.2 74.64,33.02 84.45,33.02 | R21.2 69.45,39.61 Q15.2 74.51,38.1 84.45,38.1 | R22.2 69.45,45.83 Q16.2 75.4,43.43 84.45,43.43 | R23.2 69.45,50.91 Q17.2 74.64,49.28 84.45,49.28 | R24.2 69.45,55.87 Q18.2 74.64,54.23 84.45,54.23 | R25.2 65.04,53.58 Q19.2 67.06,59.14 67.06,68.58 | R26.2 59.96,53.58 Q20.2 61.59,58.76 61.59,68.58 | R27.2 55,53.58 Q21.2 56.64,58.76 56.64,68.58 | R28.2 48.78,53.58 Q22.2 50.93,59.27 50.93,68.58 | R29.2 43.7,53.58 Q23.2 45.21,58.64 45.21,68.58 | R30.2 38.75,53.58 Q24.2 40.18,58.55 40.18,68.58
  Top 0.813: J1.3 9.05,68.58 40.18,68.58 45.21,68.58 50.93,68.58 56.64,68.58 61.59,68.58 67.06,68.58 75.95,68.58 84.45,60.07 84.45,54.23 84.45,49.28 84.45,43.43 84.45,38.1 84.45,33.02 84.45,27.3 84.45,21.84 84.45,17.02 84.45,11.3 75.69,2.54 61.71,2.54 56.68,2.54 52.07,2.54 45.45,2.54 38.1,2.54 | 40.42,2.54 33.02,2.54 | 35.29,2.54 27.94,2.54 | 29.2,2.54 24.24,2.54